# EAGLE design max6120 (EAGLE 7.2.0)
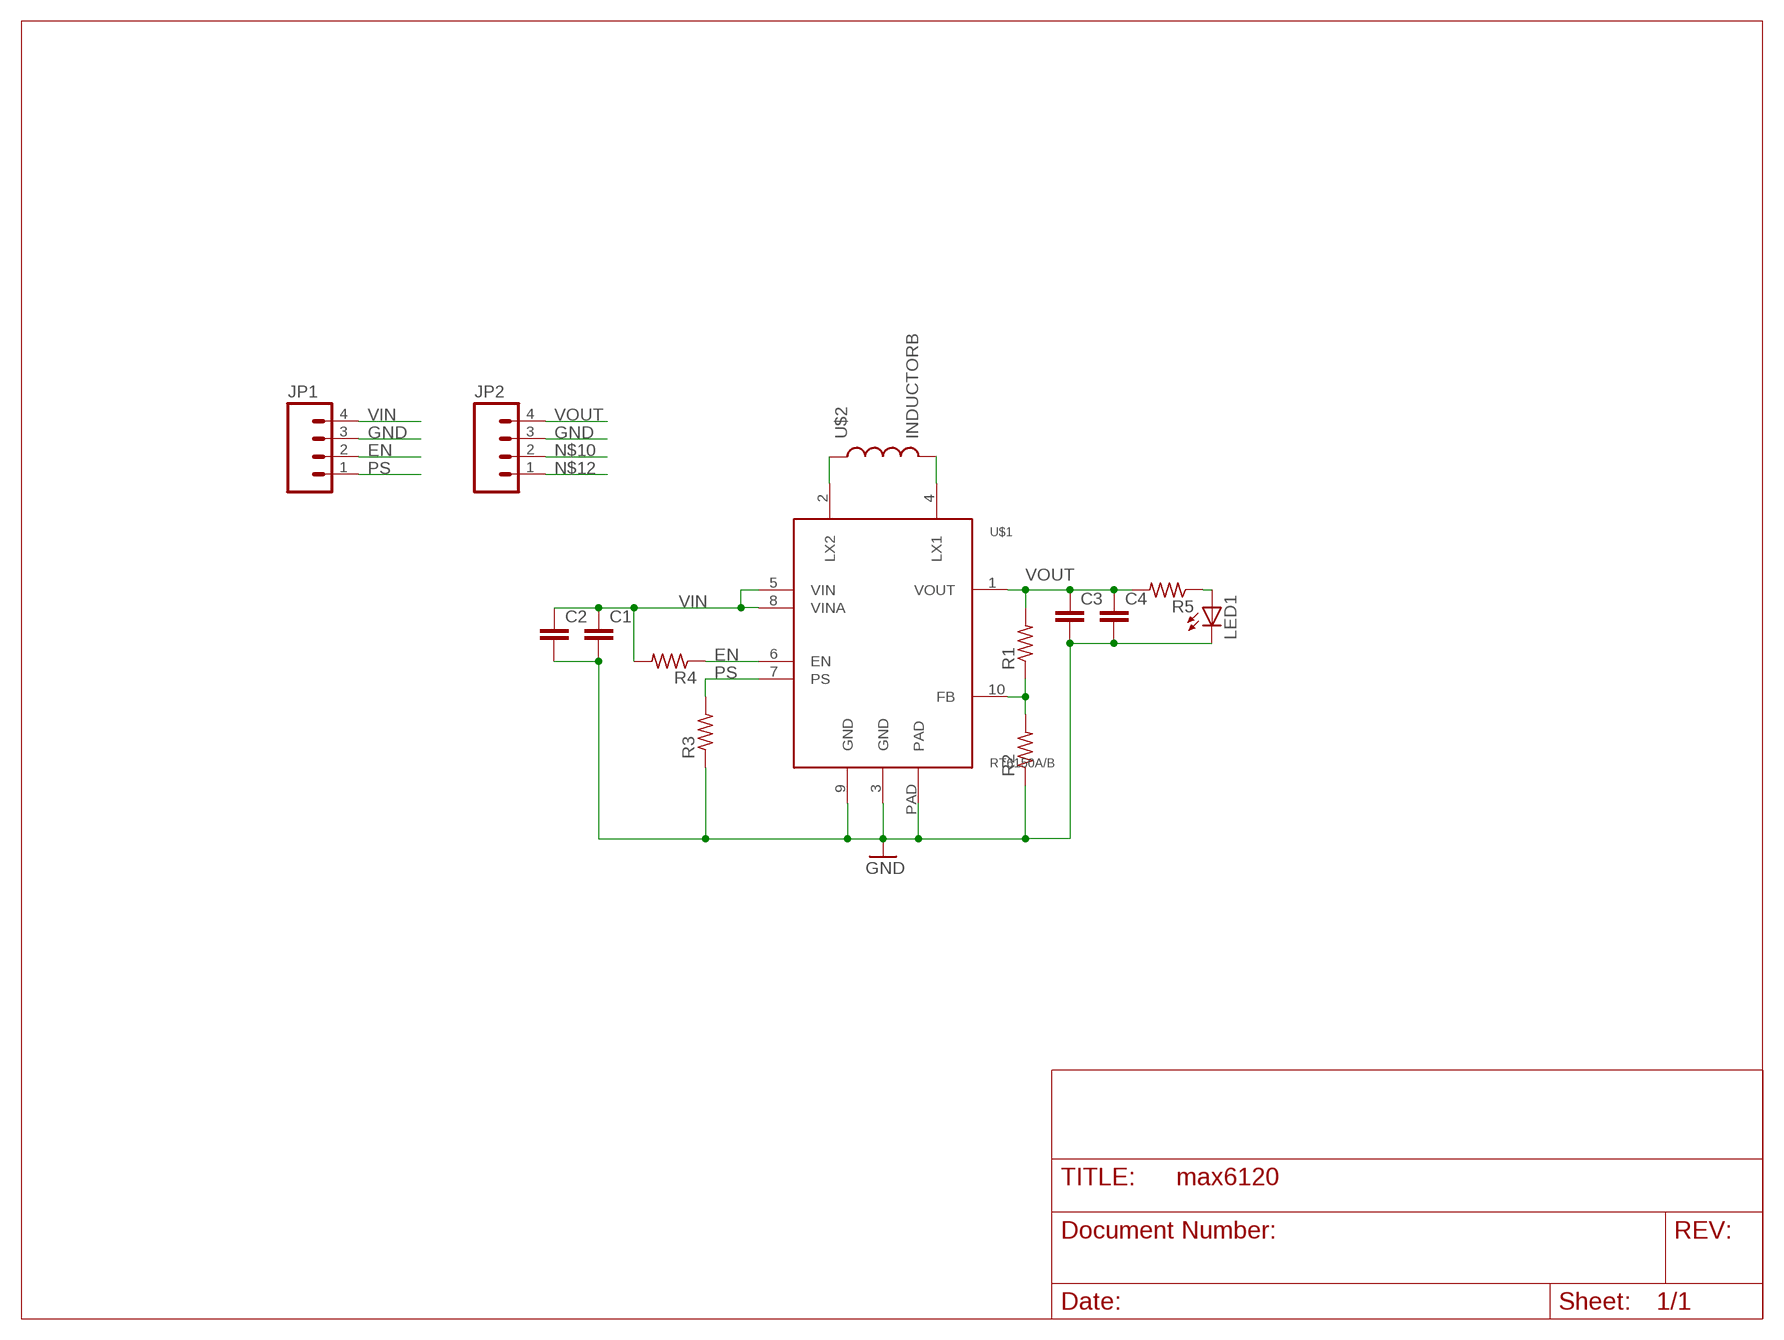
[diagram p0: schematic, sheet 1]

## Parts
C1  C-EUC0603  [C0603]
C2  C-EUC0603  [C0603]
C3  C-EUC0603  [C0603]
C4  C-EUC0603  [C0603]
JP1  M041X04_NO_SILK  [1X04_NO_SILK]
JP2  M041X04_NO_SILK  [1X04_NO_SILK]
LED1  LEDCHIP-LED0603  [CHIP-LED0603]
R1  R-US_R0402  [R0402]
R2  R-US_R0402  [R0402]
R3  R-US_R0402  [R0402]
R4  R-US_R0402  [R0402]
R5  R-US_R0402  [R0402]
U$1  RT6150A/B  [DFN3X310L]
U$2  INDUCTORB  [INDUCTOR-NR3015]

## Nets
EN: JP1.2 R4.1 U$1.6(EN)
GND: C1.2 C2.2 C3.2 C4.2 JP1.3 JP2.3 LED1.C R2.1 R3.1 U$1.3(GND) U$1.9(GND) U$1.PAD
N$1: U$1.2(LX2) U$2.1
N$2: U$1.4(LX1) U$2.2
N$6: R1.1 R2.2 U$1.10(FB)
N$10: JP2.2
N$11: LED1.A R5.1
N$12: JP2.1
PS: JP1.1 R3.2 U$1.7(PS)
VIN: C1.1 C2.1 JP1.4 R4.2 U$1.5(VIN) U$1.8(VINA)
VOUT: C3.1 C4.1 JP2.4 R1.2 R5.2 U$1.1(VOUT)

## Library data of the parts
C1-C4 = rcl:C-EU: CAPACITOR, European symbol
JP1 JP2 = SparkFun-Connectors:M04: Header 4 Standard 4-pin 0.1" header. Use with straight break away headers (SKU : PRT-00116), right angle break away headers (PRT-00553), swiss pins (PRT-00743), machine pins (PRT-00117), and female headers (PRT-00115). Molex polarized connector foot print use with SKU : PRT-08231 with associated crimp pins and housings. 1MM SMD Version SKU: PRT-10208
LED1 = led:LED: LED OSRAM: - CHIPLED LG R971, LG N971, LY N971, LG Q971, LY Q971, LO R971, LY R971 LH N974, LH R974 LS Q976, LO Q976, LY Q976 LO Q996 - Hyper CHIPLED LW Q18S LB Q993, LB Q99A, LB R99A - SideLED LS A670, LO A670, LY A670, LG A670, LP A670 LB A673, LV A673, LT A673, LW A673 LH A674 LY A675 LS A676, LA A676, LO A676, LY A676, LW A676 LS A679, LY A679, LG A679 - Hyper Micro SIDELED® LS Y876, LA Y876, LO Y876, LY Y876 LT Y87S - SmartLED LW L88C, LW L88S LB L89C, LB L89S, LG L890 LS L89K, LO L89K, LY L89K LS L896, LA L896, LO L896, LY L896 - TOPLED LS T670, LO T670, LY T670, LG T670, LP T670 LSG T670, LSP T670, LSY T670, LOP T670, LYG T670 LG T671, LOG T671, LSG T671 LB T673, LV T673, LT T673, LW T673 LH T674 LS T676, LA T676, LO T676, LY T676, LB T676, LH T676, LSB T676, LW T676 LB T67C, LV T67C, LT T67C, LS T67K, LO T67K, LY T67K, LW E67C LS E67B, LA E67B, LO E67B, LY E67B, LB E67C, LV E67C, LT E67C LW T67C LS T679, LY T679, LG T679 LS T770, LO T770, LY T770, LG T770, LP T770 LB T773, LV T773, LT T773, LW T773 LH T774 LS E675, LA E675, LY E675, LS T675 LS T776, LA T776, LO T776, LY T776, LB T776 LHGB T686 LT T68C, LB T68C - Hyper Mini TOPLED® LB M676 - Mini TOPLED Santana® LG M470 LS M47K, LO M47K, LY M47K Source: http://www.osram.convergy.de LUXEON: - LUMILED® LXK2-PW12-R00, LXK2-PW12-S00, LXK2-PW14-U00, LXK2-PW14-V00 LXK2-PM12-R00, LXK2-PM12-S00, LXK2-PM14-U00 LXK2-PE12-Q00, LXK2-PE12-R00, LXK2-PE12-S00, LXK2-PE14-T00, LXK2-PE14-U00 LXK2-PB12-K00, LXK2-PB12-L00, LXK2-PB12-M00, LXK2-PB14-N00, LXK2-PB14-P00, LXK2-PB14-Q00 LXK2-PR12-L00, LXK2-PR12-M00, LXK2-PR14-Q00, LXK2-PR14-R00 LXK2-PD12-Q00, LXK2-PD12-R00, LXK2-PD12-S00 LXK2-PH12-R00, LXK2-PH12-S00 LXK2-PL12-P00, LXK2-PL12-Q00, LXK2-PL12-R00 Source: www.luxeon.com KINGBRIGHT: KA-3528ASYC Source: www.kingbright.com
R1-R5 = rcl:R-US_: RESISTOR, American symbol
U$1 = electron:RT6150A/B
U$2 = Spark:INDUCTOR

## Board
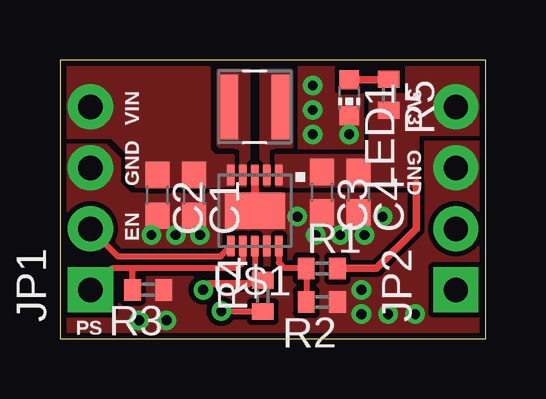
[diagram p1: board, top side]
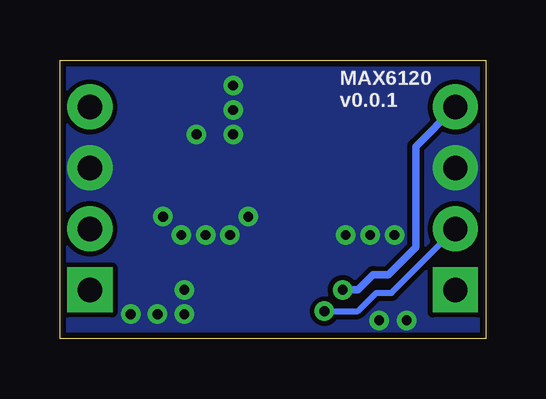
[diagram p2: board, bottom side, seen from below]

Size 17.76 x 11.61 mm. Coordinates in mm from the lower left corner, seen from the top.
Outline: 0,0 17.76,0 17.76,11.61 0,11.61 0,0
Copper layers (1*16): Top 0.035mm / dielectric 1.5mm / Bottom 0.035mm
Design rules "default *": minimum track width 10mil, minimum drill 24mil, track to track 8mil, track to pad 8mil, pad to pad 8mil, via to via 8mil, smd to smd 8mil, copper to edge 10mil, drill to drill 8mil, minimum pad ring 10mil, minimum via ring 8mil, stop-mask expansion 4mil, vias tented up to drill 23mil, thermal gap 10mil

### Footprints (pad centres in the part's own frame; a part is rotated, then mirrored left to right if it is on the bottom)
C0603 = smd 1.1 x 1: 1 -0.85,0; 2 0.85,0
1X04_NO_SILK = drill 1.016 pad 1.88 square: 1 0,0 | drill 1.016 pad 1.88: 2 2.54,0; 3 5.08,0; 4 7.62,0
CHIP-LED0603 = smd 0.8 x 0.8: A 0,-0.75; C 0,0.75
R0402 = smd 0.7 x 0.9: 1 -0.65,0; 2 0.65,0
DFN3X310L = smd 0.3 x 0.85: 1 -1,-1.475; 2 -0.5,-1.475; 3 0,-1.475; 4 0.5,-1.475; 5 1,-1.475; 6 1,1.475; 7 0.5,1.475; 8 0,1.475; 9 -0.5,1.475; 10 -1,1.475 | smd 2.5 x 1.5: PAD 0,0
INDUCTOR-NR3015 = smd 0.8 x 2.7: 1 -1.1,0; 2 1.1,0

### Placement (x,y rotation side)
C1  5.59,5.97 270 top
C2  4.06,5.97 270 top
C3  10.92,6.1 270 top
C4  12.45,6.1 270 top
JP1  1.27,2.03 90 top
JP2  16.51,2.03 90 top
LED1  12.06,10.03 180 top
R1  10.92,2.92 0 top
R2  10.92,1.52 180 top
R3  3.68,2.03 180 top
R4  8.46,1.78 90 top
R5  13.72,10.16 270 top
U$1  8.13,5.33 180 top
U$2  8.13,9.65 180 top
U$3  [SPARK_LOGO2]  3.81,8.38 0 top

### Tracks (layer width: path | path; a pad name or v marks a point on that pad's centre or on a via)
EN  (via drill 0.41)
  Top 0.254: U$1.6 6.7,3.43 2.41,3.43 JP1.2 | R4.1 7.25,1.13 v6.73,1.14
  Bottom 0.254: v6.73,1.14 5.33,1.14 4.57,1.91 3.94,1.91 JP1.2
GND  (via drill 0.41)
  Top 0.305: U$1.3 U$1.PAD
  other vias: 12.57,2.03 11.68,4.32 12.7,4.32 10.67,4.32 13.46,5.08 9.91,5.08 4.83,4.32 3.81,4.32 5.84,4.32 4.45,0.76 3.3,0.76 12.57,1.02 10.54,10.54 10.54,9.53 10.54,8.51 12.06,8.51 14.81,1.02 13.69,1.02
  pour Bottom (no thermals): 0,0 0,11.68 17.78,11.68 17.78,0
  pour Top (rank 4, no thermals): 0,11.68 17.78,11.68 17.78,0 0,0
N$1
  pour Top (rank 3, no thermals): 8.38,6.35 8.38,11.18 9.65,11.18 9.65,8 8.89,8 8.89,6.35
N$2
  pour Top (rank 3, no thermals): 7.37,6.35 7.37,8 6.6,8 6.6,11.18 7.87,11.18 7.87,6.35
N$6
  Top 0.254: R2.2 R1.1 10.25,2.95 9.35,2.95 9.13,3.17 U$1.10
N$11
  Top 0.305: LED1.A 13.69,10.78 R5.1
PS
  Top 0.254: U$1.7 7.63,3.18 7.37,2.92 2.92,2.92 | 2.92,2.92 2.16,2.92 JP1.1 | R3.2 3.03,2.81 2.92,2.92
VIN  (via drill 0.41)
  Top 0.254: U$1.8 8.13,2.56 R4.2
  Top 0.305: 8.13,2.56 7.86,2.29 6.22,2.29 v5.97,2.03
  Bottom 0.305: v5.97,2.03 5.33,2.03 4.7,2.67 4.06,2.67 2.92,3.81 2.92,8 JP1.4
  pour Top (no thermals): 7.21,6.35 3.17,6.35 2.79,6.73 2.79,7.75 2.16,8.38 0.13,8.38 0.13,11.28 6.22,11.28 6.22,7.87 6.48,7.62 7.21,7.62
VOUT
  Top 0.305: R1.2 13.21,2.92 14.86,4.57 14.86,6.48
  pour Top (rank 2, no thermals): 9.02,6.35 14.94,6.35 14.94,8.51 17.78,8.51 17.78,11.28 14.48,11.28 14.48,10.16 12.95,10.16 12.95,7.62 9.02,7.62

### Text on the board
tPlace: 3V3 | VIN | GND | GND | EN | PS
bPlace: MAX6120 / v0.0.1